# EAGLE board oboard2 (EAGLE 6.6.0), part 1 of 2
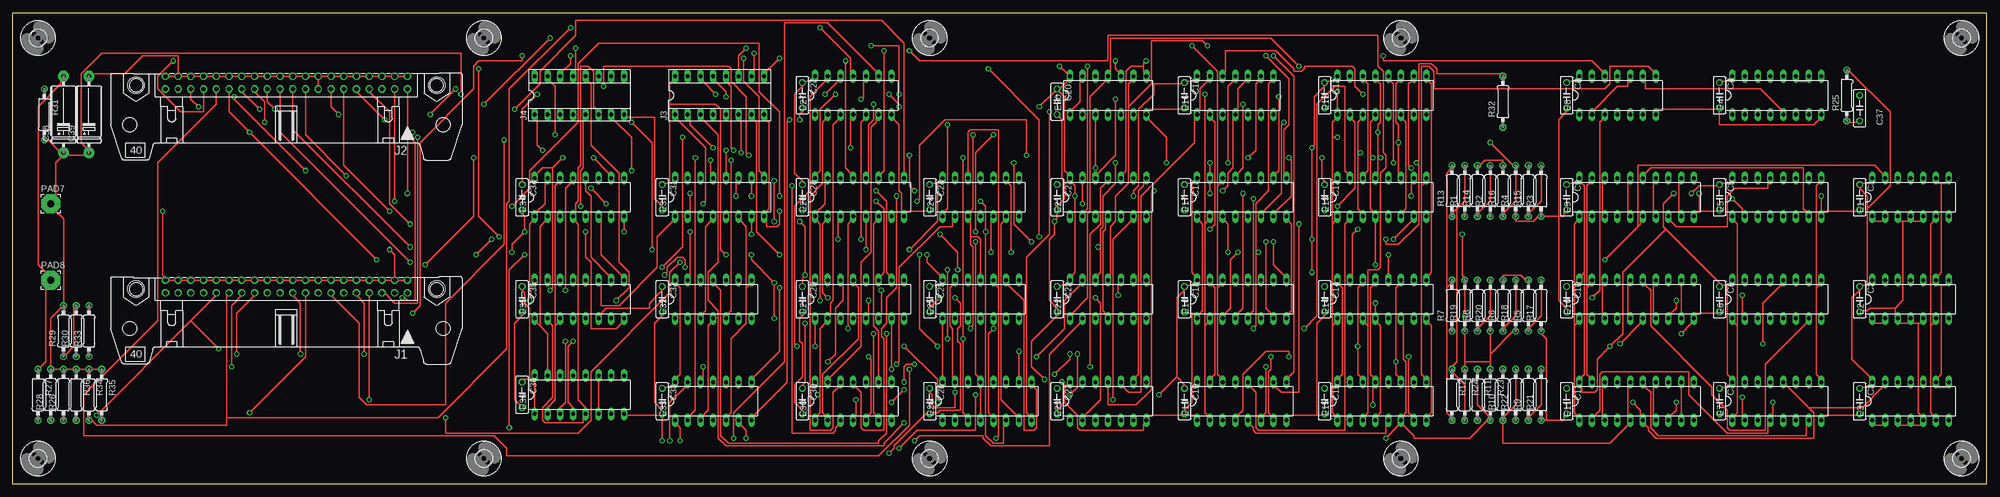
[diagram p4: board, top side]
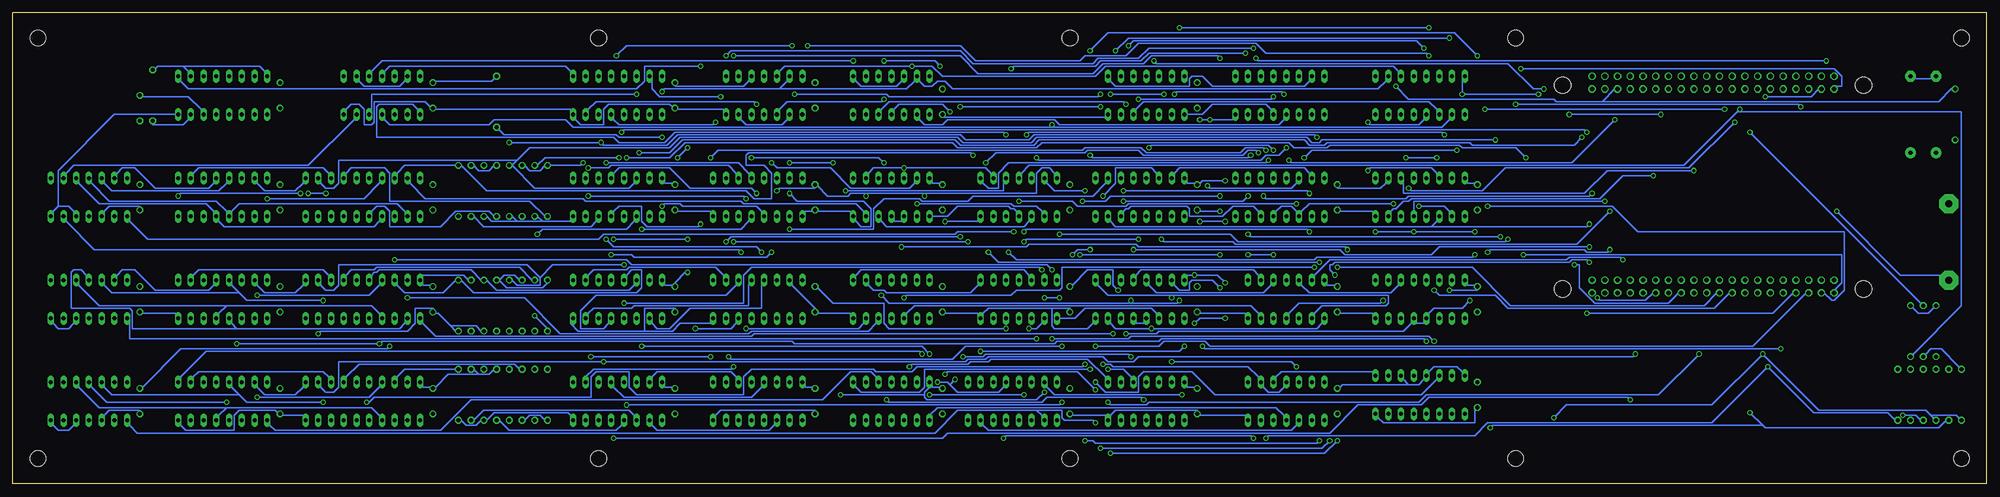
[diagram p5: board, bottom side, seen from below]

Size 393.7 x 93.98 mm. Coordinates in mm from the lower left corner, seen from the top.
Outline: 0,0 0,93.98 393.7,93.98 393.7,0 0,0
Copper layers (1*16): Top 0.035mm / dielectric 1.5mm / Bottom 0.035mm
Design rules "olimex8mil": minimum track width 10mil, minimum drill 24mil, track to track 8mil, track to pad 8mil, pad to pad 8mil, via to via 8mil, smd to smd 8mil, copper to edge 40mil, drill to drill 10mil, minimum pad ring 10mil, minimum via ring 8mil, stop-mask expansion 0mil, vias tented up to drill 0mil, thermal gap 10mil
Net classes: 1 Supply: width 0.305 mm

## Footprints (pad centres in the part's own frame; a part is rotated, then mirrored left to right if it is on the bottom)
C050-025X075 = drill 0.813 octagon: 1 -2.54,0; 2 2.54,0
E15-5 = drill 0.813 pad 2.159: + -7.62,0 | drill 0.813 pad 2.159 octagon: - 7.62,0
DIL14 = drill 0.813 long: 1 -7.62,-3.81; 2 -5.08,-3.81; 3 -2.54,-3.81; 4 0,-3.81; 5 2.54,-3.81; 6 5.08,-3.81; 7 7.62,-3.81; 8 7.62,3.81; 9 5.08,3.81; 10 2.54,3.81; 11 0,3.81; 12 -2.54,3.81; 13 -5.08,3.81; 14 -7.62,3.81
DIL16 = drill 0.813 long: 1 -8.89,-3.81; 2 -6.35,-3.81; 3 -3.81,-3.81; 4 -1.27,-3.81; 5 1.27,-3.81; 6 3.81,-3.81; 7 6.35,-3.81; 8 8.89,-3.81; 9 8.89,3.81; 10 6.35,3.81; 11 3.81,3.81; 12 1.27,3.81; 13 -1.27,3.81; 14 -3.81,3.81; 15 -6.35,3.81; 16 -8.89,3.81
DIL20 = drill 0.813 long: 1 -11.43,-3.81; 2 -8.89,-3.81; 3 -6.35,-3.81; 4 -3.81,-3.81; 5 -1.27,-3.81; 6 1.27,-3.81; 7 3.81,-3.81; 8 6.35,-3.81; 9 8.89,-3.81; 10 11.43,-3.81; 11 11.43,3.81; 12 8.89,3.81; 13 6.35,3.81; 14 3.81,3.81; 15 1.27,3.81; 16 -1.27,3.81; 17 -3.81,3.81; 18 -6.35,3.81; 19 -8.89,3.81; 20 -11.43,3.81
40H = drill 0.914: 1 -24.13,-1.27 | drill 0.914 octagon: 2 -24.13,1.27; 3 -21.59,-1.27; 4 -21.59,1.27; 5 -19.05,-1.27; 6 -19.05,1.27; 7 -16.51,-1.27; 8 -16.51,1.27; 9 -13.97,-1.27; 10 -13.97,1.27; 11 -11.43,-1.27; 12 -11.43,1.27; 13 -8.89,-1.27; 14 -8.89,1.27; 15 -6.35,-1.27; 16 -6.35,1.27; 17 -3.81,-1.27; 18 -3.81,1.27; 19 -1.27,-1.27; 20 -1.27,1.27; 21 1.27,-1.27; 22 1.27,1.27; 23 3.81,-1.27; 24 3.81,1.27; 25 6.35,-1.27; 26 6.35,1.27; 27 8.89,-1.27; 28 8.89,1.27; 29 11.43,-1.27; 30 11.43,1.27; 31 13.97,-1.27; 32 13.97,1.27; 33 16.51,-1.27; 34 16.51,1.27; 35 19.05,-1.27; 36 19.05,1.27; 37 21.59,-1.27; 38 21.59,1.27; 39 24.13,-1.27; 40 24.13,1.27 | hole 3.302: -29.972,0.533; 29.972,0.533
SOCKET-16 = drill 0.813 long: 1 -8.89,-3.81; 2 -6.35,-3.81; 3 -3.81,-3.81; 4 -1.27,-3.81; 5 1.27,-3.81; 6 3.81,-3.81; 7 6.35,-3.81; 8 8.89,-3.81; 9 8.89,3.81; 10 6.35,3.81; 11 3.81,3.81; 12 1.27,3.81; 13 -1.27,3.81; 14 -3.81,3.81; 15 -6.35,3.81; 16 -8.89,3.81
3,81/1,4 = drill 1.397 pad 3.81 octagon: 1 0,0
0207/10 = drill 0.813 octagon: 1 -5.08,0; 2 5.08,0
3,2 = hole 3.2: 0,0

## Placement (x,y rotation side)
C1  [C050-025X075]  368.3,57.15 270 top
C2  [C050-025X075]  368.3,36.83 270 top
C3  [C050-025X075]  368.3,16.51 270 top
C4  [C050-025X075]  340.36,77.47 270 top
C5  [C050-025X075]  340.36,57.15 270 top
C6  [C050-025X075]  340.36,36.83 270 top
C7  [C050-025X075]  340.36,16.51 270 top
C8  [C050-025X075]  309.88,77.47 270 top
C9  [C050-025X075]  309.88,57.15 270 top
C10  [C050-025X075]  309.88,36.83 270 top
C11  [C050-025X075]  309.88,16.51 270 top
C12  [C050-025X075]  261.62,77.47 270 top
C13  [C050-025X075]  261.62,57.15 270 top
C14  [C050-025X075]  261.62,36.83 270 top
C15  [C050-025X075]  261.62,16.51 270 top
C16  [C050-025X075]  233.68,77.47 270 top
C17  [C050-025X075]  233.68,57.15 270 top
C18  [C050-025X075]  233.68,36.83 270 top
C19  [C050-025X075]  233.68,16.51 270 top
C20  [C050-025X075]  208.28,76.2 270 top
C21  [C050-025X075]  208.28,57.15 270 top
C22  [C050-025X075]  208.28,36.83 270 top
C23  [C050-025X075]  208.28,16.51 270 top
C24  [C050-025X075]  182.88,57.15 270 top
C25  [C050-025X075]  182.88,36.83 270 top
C26  [C050-025X075]  182.88,16.51 270 top
C27  [C050-025X075]  157.48,77.47 270 top
C28  [C050-025X075]  157.48,57.15 270 top
C29  [C050-025X075]  157.48,36.83 270 top
C30  [C050-025X075]  157.48,16.51 270 top
C31  [C050-025X075]  129.54,57.15 270 top
C32  [C050-025X075]  129.54,36.83 270 top
C33  [C050-025X075]  129.54,16.51 270 top
C34  [C050-025X075]  101.6,57.15 270 top
C35  [C050-025X075]  101.6,36.83 270 top
C36  [C050-025X075]  101.6,17.78 270 top
C37  36  [C050-025X075]  368.3,74.93 90 top
C38  6.8uf  [E15-5]  10.16,73.66 90 top
C39  6.8uf  [E15-5]  15.24,73.66 90 top
E1  74LS95N  [DIL14]  378.46,57.15 0 top
E2  74LS95N  [DIL14]  378.46,36.83 0 top
E3  74LS95N  [DIL14]  378.46,16.51 0 top
E4  74LS123N  [DIL16]  351.79,77.47 0 top
E5  74LS175N  [DIL16]  351.79,57.15 0 top
E6  74LS175N  [DIL16]  351.79,36.83 0 top
E7  74LS175N  [DIL16]  351.79,16.51 0 top
E8  74LS00N  [DIL14]  320.04,77.47 0 top
E9  74S244N  [DIL20]  323.85,57.15 0 top
E10  74S244N  [DIL20]  323.85,36.83 0 top
E11  74S244N  [DIL20]  323.85,16.51 0 top
E12  74LS174N  [DIL16]  273.05,77.47 0 top
E13  74LS174N  [DIL16]  273.05,57.15 0 top
E14  74LS174N  [DIL16]  273.05,36.83 0 top
E15  74LS174N  [DIL16]  273.05,16.51 0 top
E16  74LS74N  [DIL14]  243.84,77.47 0 top
E17  74LS153N  [DIL16]  245.11,57.15 0 top
E18  74LS153N  [DIL16]  245.11,36.83 0 top
E19  74LS153N  [DIL16]  245.11,16.51 0 top
E20  74LS74N  [DIL14]  218.44,77.47 0 top
E21  74LS27N  [DIL14]  218.44,57.15 0 top
E22  74LS02N  [DIL14]  218.44,36.83 0 top
E23  7416N  [DIL14]  218.44,16.51 0 top
E24  74LS04N  [DIL14]  193.04,57.15 0 top
E25  74LS27N  [DIL14]  193.04,36.83 0 top
E26  74LS75N  [DIL16]  194.31,16.51 0 top
E27  7404N  [DIL14]  167.64,77.47 0 top
E28  74367N  [DIL16]  168.91,57.15 0 top
E29  74LS138N  [DIL16]  168.91,36.83 0 top
E30  74LS00N  [DIL14]  167.64,16.51 0 top
E31  74367N  [DIL16]  140.97,57.15 0 top
E32  74LS08N  [DIL14]  139.7,36.83 0 top
E33  74LS02N  [DIL14]  139.7,16.51 0 top
E34  74367N  [DIL16]  113.03,57.15 0 top
E35  74LS138N  [DIL16]  113.03,36.83 0 top
E36  74LS174N  [DIL16]  113.03,17.78 0 top
J1  [40H]  54.61,39.37 180 top
J2  [40H]  54.61,80.01 180 top
J3  [SOCKET-16]  140.97,77.47 0 top
J4  [SOCKET-16]  113.03,77.47 0 top
PAD7  [3,81/1,4]  7.62,55.88 0 top
PAD8  [3,81/1,4]  7.62,40.64 0 top
R1  680  [0207/10]  289.56,58.42 90 top
R2  680  [0207/10]  294.64,58.42 90 top
R3  680  [0207/10]  304.8,58.42 90 top
R4  680  [0207/10]  299.72,58.42 90 top
R5  330  [0207/10]  302.26,35.56 90 top
R6  330  [0207/10]  297.18,35.56 90 top
R7  330  [0207/10]  287.02,35.56 90 top
R8  330  [0207/10]  292.1,35.56 90 top
R9  330  [0207/10]  302.26,17.78 90 top
R10  330  [0207/10]  297.18,17.78 90 top
R11  330  [0207/10]  292.1,17.78 270 top
R12  330  [0207/10]  287.02,17.78 270 top
R13  330  [0207/10]  287.02,58.42 90 top
R14  330  [0207/10]  292.1,58.42 90 top
R15  330  [0207/10]  302.26,58.42 90 top
R16  330  [0207/10]  297.18,58.42 90 top
R17  680  [0207/10]  304.8,35.56 90 top
R18  680  [0207/10]  299.72,35.56 90 top
R19  680  [0207/10]  289.56,35.56 90 top
R20  680  [0207/10]  294.64,35.56 90 top
R21  680  [0207/10]  304.8,17.78 90 top
R22  680  [0207/10]  299.72,17.78 90 top
R23  680  [0207/10]  294.64,17.78 270 top
R24  680  [0207/10]  289.56,17.78 270 top
R25  6K8  [0207/10]  365.76,77.47 270 top
R26  180  [0207/10]  10.16,17.78 90 top
R27  390  [0207/10]  5.08,17.78 270 top
R28  1K  [0207/10]  7.62,17.78 90 top
R29  180  [0207/10]  10.16,30.48 90 top
R30  390  [0207/10]  12.7,30.48 90 top
R31  1K  [0207/10]  6.35,73.66 270 top
R32  1K  [0207/10]  297.18,76.2 90 top
R33  1K  [0207/10]  15.24,30.48 90 top
R34  1K  [0207/10]  15.24,17.78 270 top
R35  1K  [0207/10]  17.78,17.78 270 top
R36  1K  [0207/10]  12.7,17.78 270 top
U$1  [3,2]  5.08,5.08 0 top
U$2  [3,2]  5.08,88.9 0 top
U$3  [3,2]  388.62,88.9 0 top
U$4  [3,2]  388.62,5.08 0 top
U$5  [3,2]  93.98,88.9 0 top
U$6  [3,2]  182.88,5.08 0 top
U$7  [3,2]  93.98,5.08 0 top
U$8  [3,2]  276.86,5.08 0 top
U$9  [3,2]  276.86,88.9 0 top
U$10  [3,2]  182.88,88.9 0 top

## Tracks (layer width: path | path; a pad name or v marks a point on that pad's centre or on a via)
!ADRLTH
  Top 0.254: E14.9 282.45,41.66 282.96,42.16 282.96,79.76 282.45,80.26 E12.9
  Bottom 0.254: E8.11 319.53,82.3 318.52,83.31 283.46,83.31 282.45,82.3 E12.9
!BFSW  (via drill 0.61)
  Top 0.254: v100.08,74.68 105.16,79.76 105.16,82.3 112.27,89.41 112.27,92.46 173.23,92.46 177.8,87.88 177.8,61.98 E28.9 | v52.32,74.68 50.8,76.2 50.8,78.23 J2.24
  Bottom 0.254: v100.08,74.68 v52.32,74.68
!BKDTACNTL  (via drill 0.61)
  Top 0.254: v164.59,48.77 164.59,52.32 E28.3 | v75.18,54.36 66.04,63.5 66.04,78.23 J2.12
  Bottom 0.254: v164.59,48.77 164.08,48.26 150.37,48.26 149.86,47.75 81.79,47.75 v75.18,54.36
!BOOTF  (via drill 0.61)
  Top 0.254: v238.76,50.8 239.78,51.82 239.78,72.14 239.27,72.64 E16.2
  Bottom 0.254: v238.76,50.8 222,50.8 222,54.86 219.96,56.9 212.85,56.9 212.34,56.39 203.2,56.39 202.18,57.4 178.31,57.4 175.77,59.94 E28.10 | E16.6 248.41,72.64 247.4,71.63 240.28,71.63 239.27,72.64 E16.2
!BUSEN  (via drill 0.61)
  Top 0.254: v110.24,38.61 110.24,58.93 111.25,59.94 E34.13
  Bottom 0.254: v110.24,38.61 109.22,37.59 98.04,37.59 95.5,35.05 54.36,35.05 51.31,38.1 J1.24
!DEP  (via drill 0.61)
  Top 0.254: v170.18,46.74 170.18,52.32 E28.5 | v79.25,47.24 55.88,70.61 55.88,78.23 J2.20
  Bottom 0.254: v170.18,46.74 129.03,46.74 128.02,45.72 110.74,45.72 109.22,47.24 v79.25,47.24
!DSPLTH
  Top 0.254: 280.92,59.44 280.92,21.84 281.43,21.34 E15.9 | 280.92,59.44 281.43,59.94 E13.9 | 280.92,59.44 280.92,83.31 282.45,83.31 283.46,82.3 283.46,78.74 317.5,78.74 318.52,79.76 318.52,83.31 326.14,83.31 327.15,82.3 E8.8
!E35-Y4
  Top 0.254: E31.1 131.57,52.32 128.52,49.28 128.52,43.18 120.9,35.56 117.35,35.56 117.35,39.62 E35.11
  Bottom 0.254: E35.11 117.35,39.62 118.87,38.1 135.13,38.1 136.65,39.62 E32.12
!EMA0  (via drill 0.61)
  Top 0.254: 42.67,13.21 42.67,38.1 J1.30 | 42.67,13.21 42.67,11.68 16.76,11.68 15.75,12.7 R34.2 | v161.04,90.93 167.13,84.84 167.13,82.3 E27.11 | v111.25,90.93 99.06,78.74 99.06,56.39 98.55,55.88 98.55,26.92 84.84,13.21 42.67,13.21
  Bottom 0.254: v111.25,90.93 v161.04,90.93
!EMA1  (via drill 0.61)
  Top 0.254: v43.69,23.37 43.69,35.56 45.72,37.59 J1.28 | v143.76,9.14 143.76,14.22 153.92,24.38 153.92,91.95 162.56,91.95 172.21,82.3 E27.9
  Bottom 0.254: R35.2 18.29,12.7 19.81,14.22 34.54,14.22 v43.69,23.37 54.86,12.19 99.57,12.19 102.11,9.65 143.26,9.65 v143.76,9.14
!EMA2  (via drill 0.61)
  Top 0.254: 35.56,32.51 40.64,37.59 J1.32 | v16.76,13.72 35.56,32.51 | v156.46,27.43 155.96,27.94 155.96,55.37 159,58.42 159,77.22 162.05,80.26 E27.13 | 35.56,32.51 v41.15,26.92
  Bottom 0.254: v16.76,13.72 14.22,13.72 13.21,12.7 R36.2 | v156.46,27.43 155.96,26.92 v41.15,26.92
!EMODE  (via drill 0.61)
  Top 0.254: 382.52,31.5 382.52,14.22 383.03,13.72 E3.6 | 382.52,31.5 383.03,32 E2.6 | 382.52,31.5 382.52,51.82 383.03,52.32 E1.6 | v247.4,30.99 247.9,31.5 247.9,46.23 | 247.9,46.23 247.9,55.88 250.44,58.42 250.44,79.76 250.95,80.26 E16.8 | 247.9,46.23 v248.41,46.23
  Bottom 0.254: v247.4,30.99 225.04,30.99 224.03,32 E22.6 | v248.41,46.23 248.92,46.74 377.44,46.74 383.03,52.32 E1.6
!FUN  (via drill 0.61)
  Top 0.254: v191.01,30.99 191.52,31.5 191.52,47.24 191.01,47.75 191.01,49.28 | 191.01,49.28 191.01,52.32 E24.3 191.01,54.36 191.52,54.86 v191.52,69.6 | 191.01,49.28 192.53,49.28 193.04,48.77 193.04,41.66 E25.11 | v108.2,69.6 108.2,79.25 107.19,80.26 J4.15
  Bottom 0.254: v191.01,30.99 189.48,30.99 188.47,32 E25.2 | E21.5 220.47,52.32 219.46,51.31 192.02,51.31 191.01,52.32 E24.3 | v108.2,69.6 108.71,70.1 191.01,70.1 v191.52,69.6
!GATEENT  (via drill 0.61)
  Top 0.254: 313.94,39.12 313.94,21.84 314.45,21.34 E11.19 | 313.94,39.12 314.45,39.62 E10.19 | 313.94,39.12 313.94,59.44 314.45,59.94 E9.19 | v168.15,16.76 168.15,13.72 E30.4 | v219.46,16.76 219.46,48.77 223.01,52.32 E21.6
  Bottom 0.254: v168.15,16.76 168.66,17.27 187.45,17.27 188.47,16.26 218.95,16.26 v219.46,16.76 | E9.19 314.45,59.94 311.4,56.9 279.91,56.9 279.4,56.39 248.41,56.39 247.9,55.88 225.55,55.88 224.03,54.36 E21.6
!GATESR  (via drill 0.61)
  Top 0.254: 311.4,31.5 311.4,14.22 311.91,13.72 E11.1 | 311.4,31.5 311.91,32 E10.1 | v174.24,29.97 174.24,10.16 172.72,8.64 172.72,8.13 142.75,8.13 141.22,9.65 141.22,38.61 140.21,39.62 E32.11 | 311.4,31.5 311.4,51.82 311.91,52.32 E9.1
  Bottom 0.254: v174.24,29.97 245.87,29.97 246.38,29.46 309.37,29.46 311.91,32 E10.1
!IND1  (via drill 0.61)
  Top 0.254: v79.25,51.82 75.18,55.88 75.18,74.17 71.12,78.23 J2.8
  Bottom 0.254: 110.74,51.31 109.73,52.32 E34.3 | 110.74,51.31 173.74,51.31 174.75,52.32 E28.7 | v79.25,51.82 79.76,51.31 110.74,51.31
!IND2  (via drill 0.61)
  Top 0.254: v76.2,56.39 76.2,78.23 J2.4
  Bottom 0.254: v76.2,56.39 114.3,56.39 114.3,54.36 E34.5
!INIT  (via drill 0.61)
  Top 0.254: v145.8,84.84 145.8,80.26 148.84,77.22 148.84,62.48 149.35,61.98 E31.9 | v32,84.33 28.96,81.28 28.96,78.74 33.53,74.17 38.1,74.17 38.1,78.23 J2.34
  Bottom 0.254: v145.8,84.84 145.29,84.33 v32,84.33
!KEY-F  (via drill 0.61)
  Top 0.254: E26.4 193.04,13.72 193.04,19.3 E26.13 192.53,21.34 192.02,21.84 v192.02,48.26 | v169.16,48.77 169.16,72.14 169.67,72.64 E27.5
  Bottom 0.254: J4.3 109.73,74.68 111.25,76.2 168.15,76.2 169.67,74.68 E27.5 | v192.02,48.26 191.52,48.77 v169.16,48.77
!KEYCNTL  (via drill 0.61)
  Top 0.254: v139.19,64.52 139.19,61.98 E31.13 | v74.17,72.64 68.58,78.23 J2.10
  Bottom 0.254: v139.19,64.52 138.68,64.01 82.8,64.01 v74.17,72.64
!KEYSTB  (via drill 0.61)
  Top 0.254: v213.36,55.88 213.36,59.94 E21.13 | v242.32,64.01 242.32,79.25 243.33,80.26 E16.11 | v176.28,23.88 176.78,24.38 176.78,43.18 184.91,51.31 187.45,51.31 187.45,52.32 E24.2
  Bottom 0.254: E33.11 140.21,19.3 141.22,18.29 143.26,18.29 144.27,19.3 E33.9 145.29,21.34 147.32,23.37 174.24,23.37 174.75,23.88 v176.28,23.88 | v213.36,55.88 194.56,55.88 194.06,55.37 189.48,55.37 188.47,54.36 E24.2 | v242.32,64.01 241.3,62.99 230.63,62.99 226.57,58.93 214.88,58.93 213.87,59.94 E21.13
!KFUN0  (via drill 0.61)
  Top 0.254: E3.2 372.87,11.68 371.35,11.68 E3.1 | v177.8,12.19 173.74,8.13 173.74,7.62 142.24,7.62 140.72,9.14 140.72,34.54 138.68,36.58 138.68,42.16 140.72,44.2 140.72,69.6 137.67,72.64 J3.3
  Bottom 0.254: 189.48,14.73 188.47,13.72 E26.2 | 189.48,14.73 205.23,14.73 209.8,10.16 368.81,10.16 370.33,11.68 E3.1 | v177.8,12.19 178.31,12.7 183.9,12.7 184.4,13.21 184.4,14.73 189.48,14.73
!KFUN1  (via drill 0.61)
  Top 0.254: E2.1 371.35,32 372.87,32 E2.2 | v189.48,65.02 v189.48,28.96 189.48,14.22 189.99,13.72 E26.3 | v139.7,67.06 135.13,71.63 135.13,72.64 J3.2
  Bottom 0.254: v189.48,65.02 188.98,64.52 144.78,64.52 143.76,65.53 141.22,65.53 v139.7,67.06 | v189.48,28.96 370.33,28.96 370.33,32 E2.1
!KFUN2  (via drill 0.61)
  Top 0.254: E1.1 371.35,52.32 372.87,52.32 E1.2 | v137.67,55.88 138.18,56.39 138.18,67.06 132.59,72.64 J3.1 | v193.04,56.39 194.06,55.37 v194.06,50.29 194.06,9.65 195.58,8.13 197.61,8.13 197.61,11.68 E26.6
  Bottom 0.254: v137.67,55.88 171.2,55.88 171.7,55.37 181.36,55.37 182.37,56.39 v193.04,56.39 | v194.06,50.29 205.23,50.29 205.74,49.78 275.84,49.78 276.86,48.77 366.78,48.77 370.33,52.32 E1.1
!LAENAB  (via drill 0.61)
  Top 0.254: v215.9,37.08 216.92,36.07 216.92,16.76 213.87,13.72 E23.2 | v134.11,43.18 134.11,44.7 133.6,45.21 132.59,45.21 130.56,43.18 130.56,42.16 v130.05,41.66 | v79.25,44.2 53.34,70.1 53.34,78.23 J2.22
  Bottom 0.254: v215.9,37.08 215.39,37.59 194.56,37.59 193.55,38.61 184.91,38.61 184.4,39.12 184.4,43.18 v134.11,43.18 | v130.05,41.66 131.06,42.67 131.06,43.69 130.56,43.69 130.05,44.2 83.31,44.2 82.8,44.7 79.76,44.7 v79.25,44.2
!MAEN  (via drill 0.61)
  Top 0.254: v178.82,22.86 178.82,11.68 172.72,5.59 98.55,5.59 98.55,7.11 96.01,9.65 14.22,9.65 14.22,17.78 28.96,32.51 28.96,64.01 40.64,75.69 40.64,78.23 J2.32
  Bottom 0.254: v178.82,22.86 211.84,22.86 211.84,19.3 212.85,18.29 224.54,18.29 225.55,19.3 E23.8
!MALC  (via drill 0.61)
  Top 0.254: v173.74,86.36 173.74,62.48 173.23,61.98 E28.11 | v107.19,88.9 v93.98,75.69 | v37.08,75.18 35.56,76.71 35.56,78.23 J2.36
  Bottom 0.254: v173.74,86.36 171.2,88.9 v107.19,88.9 | v93.98,75.69 37.59,75.69 v37.08,75.18
!MCLOCK  (via drill 0.61)
  Top 0.254: v136.14,65.02 136.14,14.73 135.13,13.72 E33.2 | v105.66,66.55 104.65,67.56 104.65,72.64 J4.1
  Bottom 0.254: v136.14,65.02 134.62,66.55 v105.66,66.55
!MD  (via drill 0.61)
  Top 0.254: v66.55,61.47 58.42,69.6 58.42,78.23 J2.18
  Bottom 0.254: v66.55,61.47 72.64,61.47 77.22,56.9 114.81,56.9 115.32,56.39 116.33,56.39 117.86,54.86 118.36,54.86 118.87,54.36 E34.7
!MEMSTART  (via drill 0.61)
  Top 0.254: v50.29,72.14 50.29,76.2 48.26,78.23 J2.26 | v115.32,58.93 v118.36,55.88
  Bottom 0.254: E31.5 141.73,54.36 140.72,55.37 138.68,55.37 137.67,54.36 E31.3 136.65,54.36 135.13,55.88 v118.36,55.88 | v50.29,72.14 59.44,62.99 96.01,62.99 100.58,58.42 114.81,58.42 v115.32,58.93
!MH0  (via drill 0.61)
  Top 0.254: E8.2 315.47,74.68 320.04,79.25 322.07,79.25 322.07,80.26 E8.10 | 225.55,83.31 223.01,83.31 222,82.3 222,62.48 221.49,61.98 E21.10 | 225.55,83.31 225.55,82.3 E20.8 | v226.06,84.33 225.55,83.82 225.55,83.31
  Bottom 0.254: E20.12 216.41,80.26 217.42,79.25 224.54,79.25 225.55,80.26 E20.8 | v226.06,84.33 320.04,84.33 322.07,82.3 E8.10
!MSIRDIS  (via drill 0.61)
  Top 0.254: v144.27,57.4 144.27,59.94 E31.11 | v78.74,57.91 78.74,78.23 J2.2
  Bottom 0.254: v144.27,57.4 143.76,56.9 115.82,56.9 115.32,57.4 79.25,57.4 v78.74,57.91
!PANLOCK  (via drill 0.61)
  Top 0.254: v179.83,58.42 178.82,59.44 v178.82,65.53 | v146.81,65.53 146.3,66.04 146.3,77.22 143.26,80.26 143.26,82.8 142.75,83.31 117.86,83.31 v117.86,79.25
  Bottom 0.254: v179.83,58.42 185.93,58.42 187.45,59.94 E24.13 | v178.82,65.53 178.31,65.02 147.32,65.02 v146.81,65.53 | v117.86,79.25 115.32,76.71 86.36,76.71 85.85,76.2 76.71,76.2 | 76.71,76.2 74.17,78.74 J2.6 | 76.71,76.2 9.65,76.2 7.11,78.74 R31.1
!PULSELOADADD  (via drill 0.61)
  Top 0.254: v147.32,49.78 147.32,52.32 E31.7 | v97.03,49.28 92.96,53.34 v92.96,82.8
  Bottom 0.254: v147.32,49.78 146.81,49.28 v97.03,49.28 | v92.96,82.8 30.48,82.8 28.96,81.28 28.96,79.25 30.48,79.25 J2.40
!RUN  (via drill 0.61)
  Top 0.254: v47.24,14.22 58.42,25.4 58.42,37.59 J1.18 | v195.07,46.23 195.07,52.32 E24.5 | v102.11,45.72 99.06,42.67 v99.06,11.18
  Bottom 0.254: 44.7,11.68 v47.24,14.22 | 44.7,11.68 44.2,11.18 9.65,11.18 8.13,12.7 R28.1 | v195.07,46.23 193.55,44.7 134.11,44.7 133.6,45.21 102.62,45.21 v102.11,45.72 | v99.06,11.18 98.55,11.68 44.7,11.68
!SHLT
  Bottom 0.254: J3.5 142.75,74.68 143.76,75.69 154.43,75.69 156.46,73.66 159.51,73.66 E27.1
!SINGSTEP  (via drill 0.61)
  Top 0.254: v166.12,84.33 166.12,62.99 167.13,61.98 E28.13 | v83.31,73.66 v88.39,78.74 | v65.02,73.66 63.5,75.18 63.5,78.23 J2.14
  Bottom 0.254: v166.12,84.33 165.61,83.82 95.5,83.82 90.42,78.74 v88.39,78.74 | v65.02,73.66 v83.31,73.66
!SRDATA  (via drill 0.61)
  Top 0.254: R29.1 10.67,25.91 12.19,27.43 12.19,35.05 R30.2 | v72.64,44.7 v47.24,70.1 43.18,74.17 43.18,78.23 J2.30 | v195.58,69.6 192.02,66.04 v192.02,50.29 | v135.13,50.29 135.13,41.66 E32.13
  Bottom 0.254: v72.64,44.7 73.15,45.21 83.31,45.21 83.82,44.7 131.06,44.7 134.11,41.66 E32.13 | v195.58,69.6 196.09,70.1 261.62,70.1 263.65,68.07 272.8,68.07 273.81,69.09 321.06,69.09 321.06,75.18 320.55,75.69 313.94,75.69 312.93,74.68 E8.1 | v192.02,50.29 191.52,50.8 135.64,50.8 v135.13,50.29 | v47.24,70.1 13.21,36.07 R30.2
!STATE  (via drill 0.61)
  Top 0.254: v58.42,62.48 44.2,76.71 v44.2,77.22
  Bottom 0.254: v58.42,62.48 75.69,62.48 80.26,57.91 116.33,57.91 116.33,59.94 E34.11 | v44.2,77.22 35.05,77.22 33.53,78.74 J2.38
!STHIS
  Bottom 0.254: J3.4 140.21,72.64 141.22,71.63 184.91,71.63 185.93,72.64 207.26,72.64 208.28,71.63 211.84,71.63 212.85,72.64 E20.2
!TSI  (via drill 0.61)
  Top 0.254: v215.9,62.99 215.9,72.64 E20.3 | v44.7,25.91 44.7,34.04 48.26,37.59 J1.26 | v199.14,46.23 199.14,59.44 198.63,59.94 E24.9 | v133.1,44.2 131.06,42.16 131.06,38.1 115.32,22.35 115.32,12.7 112.78,10.16 86.36,10.16 v86.36,13.21
  Bottom 0.254: E24.9 198.63,61.98 199.64,62.99 v215.9,62.99 222,62.99 223.01,61.98 E21.9 | 11.18,13.72 10.67,13.21 R26.1 | 11.18,13.72 12.19,14.73 33.53,14.73 v44.7,25.91 54.86,15.75 83.82,15.75 v86.36,13.21 | 11.18,13.72 6.1,13.72 5.59,13.21 R27.2 | v199.14,46.23 197.1,44.2 v133.1,44.2
ADDR0  (via drill 0.61)
  Top 0.254: v251.46,48.26 251.46,43.69 253.49,41.66 E18.9 | v204.72,49.28 204.72,72.64 v194.56,82.8 | v147.83,85.85 147.83,82.3 J3.10
  Bottom 0.254: v251.46,48.26 250.44,49.28 v204.72,49.28 | v194.56,82.8 194.06,83.31 177.8,83.31 176.78,84.33 168.66,84.33 167.13,85.85 v147.83,85.85
ADDR1  (via drill 0.61)
  Top 0.254: v254.51,65.02 255.02,64.52 255.02,57.4 251.97,54.36 E17.7 | v143.76,66.55 143.26,67.06 143.26,79.25 142.75,79.76 142.75,80.26 J3.12
  Bottom 0.254: v254.51,65.02 252.98,66.55 180.34,66.55 179.83,67.06 168.66,67.06 167.64,66.04 148.84,66.04 147.83,67.06 144.27,67.06 v143.76,66.55
ADDR2  (via drill 0.61)
  Top 0.254: v249.94,85.34 254.51,80.77 254.51,71.63 253.49,70.61 253.49,61.98 E17.9 | v152.91,84.84 150.37,82.3 J3.9
  Bottom 0.254: v249.94,85.34 204.72,85.34 201.17,81.79 178.31,81.79 176.28,83.82 168.15,83.82 166.62,85.34 153.42,85.34 v152.91,84.84
BEMA0  (via drill 0.61)
  Top 0.254: v142.24,77.22 142.24,78.23 140.21,80.26 J3.13 | v169.16,76.71 169.67,77.22 169.67,80.26 E27.10
  Bottom 0.254: v142.24,77.22 142.75,76.71 v169.16,76.71
BEMA1
  Bottom 0.254: J3.15 135.13,80.26 136.14,79.25 154.43,79.25 156.46,81.28 158.5,81.28 159,80.77 159,79.25 173.74,79.25 174.75,80.26 E27.8
BEMA2  (via drill 0.61)
  Top 0.254: v140.21,77.72 137.67,80.26 J3.14 | v162.05,77.72 164.59,80.26 E27.12
  Bottom 0.254: v140.21,77.72 140.72,78.23 161.54,78.23 v162.05,77.72
BPOK  (via drill 0.61)
  Top 0.254: E20.1 211.33,74.68 212.85,76.2 212.85,80.26 E20.13 | 263.14,31.5 263.14,14.22 263.65,13.72 E15.1 | 263.14,31.5 263.65,32 E14.1 | 263.14,51.82 263.65,52.32 E13.1 | 263.14,31.5 263.14,51.82 | 263.14,51.82 263.14,69.09 | 263.14,69.09 263.14,72.14 263.65,72.64 E12.1 264.16,74.68 v264.16,78.23 | 263.14,69.09 v264.16,69.09 | 343.92,31.5 343.92,14.22 343.41,13.72 E7.1 | 343.92,31.5 343.41,32 E6.1 | 343.92,31.5 343.92,51.82 343.41,52.32 E5.1 | E23.10 221.49,19.3 222.5,18.29 225.04,18.29 225.04,57.4 235.71,68.07 235.71,72.64 E16.1 236.73,74.68 236.73,78.74 238.25,80.26 E16.13
  Bottom 0.254: J4.10 119.89,80.26 121.41,78.74 206.25,78.74 207.77,80.26 209.3,80.26 210.31,79.25 211.84,79.25 212.85,80.26 E20.13 213.87,80.26 215.39,78.74 240.79,78.74 | v264.16,69.09 272.8,69.09 273.3,69.6 295.66,69.6 296.67,70.61 R32.1 | E7.1 342.39,11.68 341.38,10.67 308.36,10.67 302.26,16.76 232.16,16.76 226.57,22.35 222.5,22.35 221.49,21.34 E23.10 | v264.16,78.23 263.65,78.74 240.79,78.74 | 240.79,78.74 239.27,80.26 E16.13
BRUN  (via drill 0.61)
  Top 0.254: E26.7 200.15,13.72 197.1,16.76 197.1,51.82 197.61,52.32 E24.6 | E33.3 137.67,13.72 138.68,14.73 138.68,31.5 139.19,32 E32.4 | v120.4,36.58 122.94,39.12 122.94,42.16 120.9,44.2 120.9,61.98 115.32,67.56 115.32,79.76 114.81,80.26 J4.12
  Bottom 0.254: v120.4,36.58 120.9,36.07 137.16,36.07 139.19,34.04 E32.4 | E26.7 200.15,11.68 199.14,10.67 138.68,10.67 137.67,11.68 E33.3
BUS0  (via drill 0.61)
  Top 0.254: E11.3 316.99,13.72 316.99,19.3 E11.18 | R9.1 302.26,13.21 304.8,15.75 304.8,22.35 R21.2 | 270.26,31.5 270.26,14.22 269.75,13.72 E15.3 | 270.26,31.5 269.75,32 E14.3 | v79.76,34.04 81.28,35.56 81.28,68.07 91.95,78.74 91.95,83.31 92.96,84.33 101.6,84.33 v101.6,85.34 | v178.82,86.36 180.85,84.33 218.44,84.33 218.44,89.41 272.29,89.41 272.29,83.31 273.3,82.3 273.3,66.04 273.81,65.53 273.81,62.99 272.8,61.98 272.8,43.18 272.29,42.67 270.26,42.67 270.26,31.5
  Bottom 0.254: E11.18 316.99,21.34 315.47,22.86 305.31,22.86 R21.2 | v79.76,34.04 42.67,34.04 38.61,38.1 J1.34 | v101.6,85.34 106.17,89.92 175.26,89.92 v178.82,86.36 | R9.1 301.75,12.7 299.72,14.73 270.76,14.73 269.75,13.72 E15.3
BUS1  (via drill 0.61)
  Top 0.254: E10.3 316.99,34.04 316.99,39.62 E10.18 | R5.1 302.26,30.99 304.8,33.53 304.8,40.13 R17.2 | E14.13 271.27,39.62 270.76,39.12 270.76,21.84 271.27,21.34 E15.13 271.27,19.3 v271.27,15.75 | v177.8,27.43 184.4,20.83 v184.4,16.26
  Bottom 0.254: E10.18 316.99,39.62 315.47,38.1 307.85,38.1 305.31,40.64 R17.2 304.29,40.64 301.75,38.1 269.24,38.1 268.22,39.12 268.22,42.67 270.26,42.67 271.27,41.66 E14.13 | v177.8,27.43 165.1,27.43 164.08,28.45 155.96,28.45 154.94,27.43 46.74,27.43 36.07,38.1 J1.36 | v184.4,16.26 184.91,15.75 v271.27,15.75
BUS2  (via drill 0.61)
  Top 0.254: E13.6 277.37,54.36 277.88,54.86 277.88,72.14 277.37,72.64 E12.6 | E9.3 316.99,54.36 316.99,59.94 E9.18 | R15.1 302.26,53.85 304.8,56.39 304.8,62.99 R3.2 | v99.57,55.37 103.12,58.93 103.12,62.48 112.78,72.14 112.78,83.82 116.84,87.88 148.84,87.88 148.84,78.23 152.91,74.17 v152.91,57.4 | v180.34,56.39 180.85,56.9 180.85,67.56 185.93,72.64 202.18,72.64 v202.18,65.53
  Bottom 0.254: v99.57,55.37 74.68,55.37 69.6,50.29 28.45,50.29 28.45,38.61 30.48,36.58 30.99,36.58 32.51,38.1 J1.38 | v152.91,57.4 174.75,57.4 175.77,56.39 v180.34,56.39 | v202.18,65.53 202.69,66.04 246.89,66.04 247.4,65.53 247.4,63.5 243.84,63.5 242.32,61.98 242.32,56.9 245.87,56.9 247.4,58.42 299.21,58.42 304.29,63.5 R3.2 305.31,63.5 315.47,63.5 316.99,61.98 E9.18 | E13.6 277.37,52.32 278.38,51.31 299.72,51.31 301.75,53.34 R15.1
BUS3  (via drill 0.61)
  Top 0.254: E11.16 322.07,19.3 322.07,13.72 E11.5 322.07,11.68 318.52,8.13 297.18,8.13 297.18,12.19 R10.1 297.18,13.21 299.72,15.75 299.72,22.35 R22.2 | E15.4 272.29,13.72 272.8,14.22 272.8,31.5 272.29,32 E14.4 271.78,34.04 v271.78,36.07 | v95.5,48.77 v92.46,45.72 | v184.91,49.78 188.47,46.23 v188.47,42.67
  Bottom 0.254: v92.46,45.72 28.96,45.72 28.96,40.13 30.48,38.61 J1.40 | v95.5,48.77 96.01,48.26 149.35,48.26 150.88,49.78 v184.91,49.78 | v188.47,42.67 188.98,43.18 246.38,43.18 247.9,41.66 247.9,36.07 v271.78,36.07 | R10.1 296.67,12.7 294.64,10.67 273.3,10.67 272.29,11.68 E15.4
BUS4  (via drill 0.61)
  Top 0.254: E10.5 322.07,34.04 322.07,39.62 E10.16 | R6.1 297.18,30.99 299.72,33.53 299.72,40.13 R18.2 | E15.14 268.73,21.34 268.22,21.84 v268.22,27.43 268.22,39.12 268.73,39.62 E14.14 | v57.4,25.91 57.4,36.07 55.88,37.59 J1.20 | v177.8,18.8 v175.26,16.26 | v207.77,21.84 210.82,24.89 v210.82,25.91
  Bottom 0.254: E10.16 322.07,41.66 321.56,42.16 321.06,42.16 320.55,42.67 302.26,42.67 300.23,40.64 R18.2 299.21,40.64 297.18,38.61 270.76,38.61 269.75,39.62 E14.14 | v57.4,25.91 65.53,17.78 111.76,17.78 113.28,16.26 167.13,16.26 167.64,15.75 174.75,15.75 v175.26,16.26 | v177.8,18.8 181.36,22.35 207.26,22.35 v207.77,21.84 | v210.82,25.91 212.34,27.43 v268.22,27.43
BUS5  (via drill 0.61)
  Top 0.254: E9.5 322.07,54.36 322.07,59.94 E9.16 | R16.1 297.18,53.85 299.72,56.39 299.72,62.99 R4.2 299.21,63.5 v294.64,68.07 | E13.11 276.35,61.98 v276.35,68.07 276.35,71.63 275.84,72.14 275.84,79.76 276.35,80.26 E12.11 | v129.54,43.18 133.6,47.24 v133.6,69.09
  Bottom 0.254: E9.5 322.07,54.36 321.06,55.37 319.53,55.37 318.52,54.36 318.52,51.31 308.36,51.31 305.31,54.36 298.7,54.36 297.69,53.34 R16.1 | v129.54,43.18 102.62,43.18 95,35.56 56.39,35.56 53.85,38.1 J1.22 | v133.6,69.09 134.11,69.6 189.99,69.6 191.01,68.58 203.71,68.58 204.72,69.6 261.11,69.6 263.14,67.56 275.84,67.56 v276.35,68.07 v294.64,68.07
BUS6  (via drill 0.61)
  Top 0.254: E11.7 327.15,13.72 327.15,19.3 E11.14 | R11.1 292.1,22.35 292.1,15.75 294.64,13.21 R23.2 294.13,12.7 290.58,9.14 279.4,9.14 279.4,9.65 277.37,11.68 E15.6 | E15.6 277.37,13.72 277.88,14.22 277.88,24.38 277.37,24.89 277.37,32 E14.6 | v71.12,16.76 71.12,37.59 J1.8 | v273.81,9.14 276.35,11.68 E15.6
  Bottom 0.254: E11.14 327.15,21.34 324.61,23.88 293.62,23.88 292.61,22.86 R11.1 | v71.12,16.76 71.63,17.27 111.25,17.27 112.78,15.75 125.48,15.75 131.06,10.16 207.26,10.16 208.28,9.14 v273.81,9.14
BUS7  (via drill 0.61)
  Top 0.254: E10.7 327.15,34.04 327.15,39.62 E10.14 | v289.56,33.53 289.56,40.13 R19.2 289.56,41.15 289.05,41.66 v289.05,49.78 | 268.22,66.04 268.22,72.14 268.73,72.64 E12.3 | 268.22,66.04 268.22,54.86 268.73,54.36 E13.3 | v80.77,69.09 80.77,36.07 76.2,36.07 74.17,38.1 J1.6 | v268.73,66.04 268.22,66.04
  Bottom 0.254: v289.56,33.53 287.02,30.99 R7.1 | E10.14 327.15,41.66 326.14,42.67 321.56,42.67 321.06,43.18 292.61,43.18 290.07,40.64 R19.2 | v80.77,69.09 82.3,67.56 102.62,67.56 103.12,68.07 131.57,68.07 132.08,67.56 135.13,67.56 136.14,68.58 188.98,68.58 189.99,67.56 204.72,67.56 205.74,68.58 260.1,68.58 262.64,66.04 v268.73,66.04 | v289.05,49.78 288.04,50.8 271.27,50.8 269.75,52.32 E13.3
BUS8  (via drill 0.61)
  Top 0.254: R24.2 289.56,13.21 289.56,19.81 287.02,22.35 R12.1 287.02,23.37 288.04,24.38 288.04,54.86 | E9.7 327.15,54.36 327.15,59.94 E9.14 | 288.04,54.86 289.56,56.39 289.56,62.99 R1.2 | 288.04,54.86 287.02,53.85 R13.1 | 272.29,65.02 v272.29,70.1 272.29,71.63 272.8,72.14 272.8,79.76 272.29,80.26 E12.13 | 272.29,65.02 272.29,61.98 E13.13 | v77.72,37.08 78.23,37.08 78.74,36.58 80.26,36.58 80.26,68.07 79.76,68.58 v79.76,70.1 | v272.8,65.02 272.29,65.02
  Bottom 0.254: E9.14 327.15,61.98 326.14,62.99 319.53,62.99 318.52,61.98 318.52,56.39 290.58,56.39 287.53,53.34 R13.1 | v77.72,37.08 77.22,36.58 68.07,36.58 66.55,38.1 J1.12 | v79.76,70.1 80.26,70.61 271.78,70.61 v272.29,70.1 | v272.8,65.02 287.53,65.02 289.05,63.5 R1.2
BUS9  (via drill 0.61)
  Top 0.254: E11.9 332.74,13.72 332.74,19.3 E11.12 | E15.11 276.35,21.34 275.84,21.84 v275.84,24.38 275.84,39.12 276.35,39.62 E14.11 | v70.1,25.91 70.1,36.07 68.58,37.59 J1.10
  Bottom 0.254: v70.1,25.91 70.61,25.4 169.16,25.4 170.18,24.38 175.26,24.38 176.28,25.4 199.14,25.4 199.64,24.89 203.2,24.89 203.71,24.38 v275.84,24.38 328.68,24.38 328.68,19.3 329.69,18.29 331.22,18.29 332.23,19.3 E11.12
BUS10  (via drill 0.61)
  Top 0.254: E10.9 332.74,34.04 332.74,39.62 E10.12 | R8.1 292.1,30.99 294.64,33.53 294.64,40.13 R20.2 | 270.76,65.02 270.76,72.14 271.27,72.64 E12.4 | 270.76,65.02 270.76,54.86 271.27,54.36 E13.4 271.78,52.32 v271.78,43.69 | v82.3,43.69 91.95,53.34 v91.95,65.02 | v271.27,65.02 270.76,65.02
  Bottom 0.254: 288.54,41.15 291.08,43.69 328.68,43.69 328.68,39.62 329.69,38.61 331.22,38.61 332.23,39.62 E10.12 | 288.54,41.15 288.54,39.62 293.12,39.62 294.13,40.64 R20.2 | v82.3,43.69 81.28,43.69 81.28,39.12 78.23,36.07 63.5,36.07 61.47,38.1 J1.16 | v91.95,65.02 93.98,67.06 104.65,67.06 105.16,67.56 131.06,67.56 131.57,67.06 138.18,67.06 139.19,68.07 188.47,68.07 189.48,67.06 205.23,67.06 206.25,68.07 259.59,68.07 262.64,65.02 v271.27,65.02 | 288.54,41.15 286,43.69 v271.78,43.69
BUS11  (via drill 0.61)
  Top 0.254: E13.14 269.75,61.98 270.26,62.48 270.26,79.76 269.75,80.26 E12.14 | E9.9 332.23,54.36 332.23,59.94 E9.12 | R14.1 292.1,53.85 294.64,56.39 294.64,62.99 R2.2 | v98.04,68.58 98.04,47.75 86.36,36.07 86.36,15.75 70.61,15.75 69.09,17.27 69.09,32 63.5,37.59 J1.14
  Bottom 0.254: v98.04,68.58 132.59,68.58 133.1,68.07 134.62,68.07 135.64,69.09 189.48,69.09 190.5,68.07 204.22,68.07 205.23,69.09 260.6,69.09 262.64,67.06 290.58,67.06 293.12,64.52 | 293.12,64.52 294.13,63.5 | 294.13,63.5 R2.2 294.13,63.5 | 293.12,64.52 328.68,64.52 328.68,59.94 329.69,58.93 331.22,58.93 332.23,59.94 E9.12 | 294.13,63.5 289.56,58.93 270.76,58.93 269.75,59.94 E13.14
DISP0  (via drill 0.61)
  Top 0.254: 105.16,31.5 106.68,29.97 106.68,22.86 E36.15 | 105.16,31.5 104.65,32 E35.1 | 105.16,31.5 105.16,51.31 106.17,52.32 E34.2 | v113.28,55.37 113.28,62.48 113.79,62.99 113.79,72.64 J4.5
  Bottom 0.254: v113.28,55.37 108.2,55.37 107.19,54.36 E34.2
DISP1
  Top 0.254: E35.2 107.19,32 107.7,31.5 107.7,17.27 105.66,15.24 105.66,12.7 106.17,12.19 113.79,12.19 113.79,13.21 E36.5 114.3,15.24 112.78,16.76 112.78,51.82 112.27,52.32 E34.4 112.27,54.36 112.27,55.88 112.78,56.39 112.78,62.99 113.28,63.5 113.28,83.31 114.81,83.31 115.82,82.3 115.82,75.18 116.33,74.68 J4.6
DISP2  (via drill 0.61)
  Top 0.254: 108.2,31.5 108.2,16.76 106.68,15.24 E36.2 | 108.2,31.5 108.71,32 E35.3 | 108.2,31.5 108.2,59.44 108.71,59.94 E34.14 | v123.44,62.48 123.44,69.09 119.89,72.64 J4.7
  Bottom 0.254: v123.44,62.48 122.94,62.99 110.74,62.99 109.73,61.98 E34.14
DISPINH  (via drill 0.61)
  Top 0.254: 216.92,47.24 216.92,50.8 217.42,51.31 217.42,57.4 219.96,59.94 v219.96,64.01 | 216.92,47.24 216.92,42.16 216.41,41.66 E22.12 | v246.38,65.02 247.9,66.55 247.9,79.76 248.41,80.26 E16.9 | v123.44,72.14 127.51,68.07 v127.51,46.74 | 216.92,47.24 v216.41,47.24
  Bottom 0.254: v219.96,64.01 220.98,65.02 v246.38,65.02 | v123.44,72.14 122.94,71.63 113.28,71.63 112.27,72.64 J4.4 | v127.51,46.74 128.02,47.24 169.16,47.24 169.67,47.75 191.01,47.75 191.52,47.24 v216.41,47.24
DISPLAY0  (via drill 0.61)
  Top 0.254: v250.95,25.4 250.95,22.86 250.44,22.35 250.44,14.22 250.95,13.72 E19.7 | v184.4,27.43 180.85,30.99 v180.85,45.72 | v152.91,45.72 148.34,50.29 148.34,72.14 147.83,72.64 J3.7
  Bottom 0.254: v250.95,25.4 250.44,24.89 206.25,24.89 203.71,27.43 v184.4,27.43 | v180.85,45.72 v152.91,45.72
DISPLAY1  (via drill 0.61)
  Top 0.254: v251.46,85.34 255.52,81.28 255.52,22.35 254.51,21.34 E19.9 | v146.3,86.87 144.78,85.34 144.78,82.3 J3.11
  Bottom 0.254: v251.46,85.34 250.44,86.36 204.72,86.36 202.18,83.82 178.31,83.82 177.29,84.84 169.16,84.84 167.13,86.87 v146.3,86.87
DISPLAY2  (via drill 0.61)
  Top 0.254: v249.94,48.26 249.94,35.05 250.95,34.04 E18.7 | v203.2,48.26 199.64,51.82 v199.64,64.01 | v145.29,66.04 145.29,72.64 J3.6
  Bottom 0.254: v203.2,48.26 v249.94,48.26 | v199.64,64.01 197.61,66.04 179.83,66.04 179.32,66.55 169.16,66.55 168.15,65.53 148.34,65.53 147.32,66.55 145.8,66.55 v145.29,66.04
ENT0  (via drill 0.61)
  Top 0.254: 358.14,15.24 353.57,19.81 E7.12 | 358.14,15.24 359.16,14.22 359.16,9.14 327.66,9.14 326.14,10.67 326.14,11.18 325.63,11.68 E11.6 324.61,13.72 324.61,14.73 v323.09,16.26 | 358.14,15.24 368.81,15.24 372.87,19.3 E3.13 | v177.8,20.32 177.8,23.37 178.31,23.88 v179.83,23.88
  Bottom 0.254: v177.8,20.32 175.77,18.29 169.16,18.29 169.16,21.34 168.15,22.35 158.5,22.35 153.92,17.78 112.78,17.78 109.73,20.83 E36.14 | v179.83,23.88 180.34,23.37 213.36,23.37 214.38,22.35 221.49,22.35 222,22.86 246.38,22.86 247.9,21.34 247.9,17.78 269.24,17.78 270.76,19.3 270.76,22.35 277.37,22.35 278.38,21.34 278.38,17.27 321.56,17.27 322.58,16.26 v323.09,16.26
ENT1  (via drill 0.61)
  Top 0.254: v111.76,28.45 110.74,27.43 110.74,16.26 111.76,15.24 E36.4 | v320.55,27.94 324.61,32 E10.6 | v349,27.94 349,36.07 352.55,39.62 E6.12
  Bottom 0.254: E6.12 353.57,39.62 354.58,38.61 365.25,38.61 369.32,42.67 371.86,42.67 372.87,41.66 E2.13 | v111.76,28.45 112.27,28.96 164.59,28.96 165.1,28.45 185.42,28.45 185.93,27.94 237.74,27.94 238.25,28.45 320.04,28.45 v320.55,27.94 v349,27.94
ENT2  (via drill 0.61)
  Top 0.254: v110.24,28.45 110.24,16.26 109.22,15.24 E36.3 | v186.44,42.67 v186.44,28.96 | 324.1,51.31 324.61,51.82 324.61,52.32 E9.6 | v317.5,44.7 324.1,51.31 | 324.1,51.31 324.1,63.5 371.35,63.5 372.87,61.98 E1.13
  Bottom 0.254: E5.12 353.57,59.94 354.58,58.93 365.25,58.93 369.32,62.99 371.86,62.99 372.87,61.98 E1.13 | v110.24,28.45 111.25,29.46 170.69,29.46 171.2,28.96 v186.44,28.96 | v186.44,42.67 187.45,43.69 270.26,43.69 271.27,44.7 v317.5,44.7
GND  (via drill 0.61)
  Top 0.305: E3.3 376.43,11.68 377.95,11.68 E3.4 378.97,11.68 380.49,11.68 E3.5 380.49,13.72 379.98,14.22 379.98,32 | E7.8 361.19,13.72 367.79,13.72 C3.2 | E8.7 328.17,74.68 339.85,74.68 C4.2 340.36,74.17 340.36,71.63 359.16,71.63 360.17,72.64 E4.8 | 379.98,32 378.97,32 E2.4 377.95,32 376.43,32 E2.3 375.41,34.04 375.41,35.05 | 379.98,32 380.49,32 E2.5 | 375.41,35.05 370.33,35.05 369.82,34.54 368.81,34.54 C2.2 | 376.94,52.32 377.95,52.32 E1.4 378.97,52.32 380.49,52.32 E1.5 | 376.94,52.32 376.43,52.32 E1.3 | 336.3,54.36 339.85,54.36 C5.2 | 336.3,54.36 335.79,54.36 E9.10 | C1.2 367.79,54.36 361.19,54.36 E5.8 360.68,54.36 v360.68,57.4 | v336.3,57.91 336.3,54.36 | 375.41,35.05 376.94,36.58 376.94,52.32 | 308.36,53.34 309.37,53.34 309.37,54.36 C9.2 | 308.36,53.34 305.31,53.34 R3.1 304.29,53.34 303.28,52.32 299.72,52.32 299.72,52.83 R4.1 | 289.56,24.38 289.56,29.97 R19.1 | 289.56,24.38 289.56,23.37 R24.1 | 294.64,25.91 294.64,29.97 R20.1 | 294.64,25.91 294.64,24.38 | 294.64,24.38 294.64,23.37 R23.1 | 294.64,25.91 299.21,30.48 R18.1 | 294.64,24.38 289.56,24.38 | C6.2 339.85,34.04 335.79,34.04 E10.10 334.77,32 v332.74,29.97 | 308.36,53.34 308.36,36.58 309.88,35.05 C10.2 | 308.36,53.34 308.36,72.64 309.88,74.17 C8.2 | C36.2 101.09,15.75 100.08,16.76 100.08,32 101.6,33.53 C35.2 | E36.8 122.43,13.72 129.03,13.72 C33.2 | C33.2 129.54,14.73 128.02,16.26 128.02,32 129.54,33.53 C32.2 | J4.8 122.43,73.15 128.02,73.15 128.02,56.9 129.54,55.37 C31.2 | v121.92,50.29 121.92,52.32 E34.8 | C34.2 101.6,53.85 102.11,53.34 v102.11,50.29 99.57,47.75 v99.57,46.23 | v114.3,50.29 114.3,45.21 115.32,44.2 115.32,30.99 120.4,30.99 121.41,32 E35.8
  Top 0.305: J1.3 75.69,40.64 74.17,40.64 J1.5 73.15,40.64 71.63,40.64 J1.7 70.61,40.64 69.09,40.64 J1.9 68.07,40.64 66.55,40.64 J1.11 65.53,40.64 64.01,40.64 J1.13 62.99,40.64 61.47,40.64 J1.15 60.45,40.64 58.93,40.64 J1.17 57.91,40.64 56.39,40.64 J1.19 55.37,40.64 53.85,40.64 J1.21 52.83,40.64 51.31,40.64 J1.23 50.29,40.64 48.77,40.64 J1.25 47.75,40.64 46.23,40.64 J1.27 45.21,40.64 43.69,40.64 J1.29 42.67,40.64 41.15,40.64 J1.31 40.13,40.64 38.61,40.64 J1.33 37.59,40.64 36.07,40.64 J1.35 35.05,40.64 33.53,40.64 J1.37 32.51,40.64 30.99,40.64 J1.39 30.48,41.15 29.97,41.66 v29.97,54.36 | J1.1 78.23,40.64 76.71,40.64 J1.3 | R27.1 5.59,23.37 6.6,24.38 6.6,39.12 PAD8.1 6.6,42.16 5.08,43.69 5.08,75.18 9.65,79.76 9.65,80.26 C38.- | J2.16 60.96,79.25 60.96,80.77 J2.15 | J2.15 61.47,81.28 62.99,81.28 J2.13 64.01,81.28 65.53,81.28 J2.11 66.55,81.28 68.07,81.28 J2.9 69.09,81.28 70.61,81.28 J2.7 71.63,81.28 73.15,81.28 J2.5 74.17,81.28 75.69,81.28 J2.3 76.71,81.28 78.23,81.28 J2.1 | J2.39 30.99,81.28 32.51,81.28 J2.37 | J2.37 33.53,81.28 35.05,81.28 J2.35 36.07,81.28 37.59,81.28 J2.33 38.61,81.28 40.13,81.28 J2.31 41.15,81.28 42.67,81.28 J2.29 43.69,81.28 45.21,81.28 J2.27 46.23,81.28 47.75,81.28 J2.25 48.77,81.28 50.29,81.28 J2.23 51.31,81.28 52.83,81.28 J2.21 53.85,81.28 55.37,81.28 J2.19 56.39,81.28 57.91,81.28 J2.17 58.93,81.28 60.45,81.28 J2.15 | C39.- 16.26,81.79 22.35,81.79 25.91,85.34 33.02,85.34 33.02,81.79 J2.37 | v75.18,46.74 76.2,45.72 76.2,41.15 J1.3 | E18.8 254.51,34.04 255.02,34.54 255.02,51.82 254.51,52.32 E17.8
  Top 0.305: 305.82,12.7 309.37,12.7 309.37,13.72 C11.2 | 305.82,12.7 305.31,12.7 R21.1 | E14.8 282.45,32 282.96,31.5 282.96,14.22 282.45,13.72 E15.8 | J3.8 150.37,72.64 150.88,72.14 150.88,54.86 150.37,54.36 E31.8 150.37,52.32 150.37,51.31 152.4,51.31 152.91,51.82 v152.91,54.36 | v156.97,72.64 156.97,73.66 157.48,74.17 C27.2 | C29.2 157.48,33.53 156.97,33.02 156.97,28.45 157.48,27.94 157.48,21.34 155.96,19.81 155.96,16.26 157.48,14.73 C30.2 | v154.94,72.64 154.43,72.14 154.43,20.32 147.83,13.72 E33.7 | C24.2 182.37,54.36 178.31,54.36 E28.8 177.29,54.36 177.29,57.91 176.78,58.42 176.78,71.63 175.77,72.64 E27.7 | C20.2 208.79,73.15 209.3,72.64 209.3,60.96 209.8,60.45 209.8,56.9 208.28,55.37 C21.2 208.28,53.85 208.28,52.83 v207.77,52.32 207.77,49.78 206.76,48.77 206.76,36.58 208.28,35.05 C22.2 208.28,33.53 203.2,28.45 203.2,23.37 v205.74,20.83 | C16.2 233.17,74.68 226.57,74.68 E20.7 226.57,72.64 230.12,69.09 v230.12,64.01 | v238.76,57.91 238.76,59.94 E17.15 238.76,61.98 v238.76,64.01 | 260.1,13.72 261.11,13.72 C15.2 | 260.1,13.72 254.51,13.72 E19.8 | 260.1,13.72 260.1,32 261.62,33.53 C14.2 | E19.15 239.27,21.34 239.78,21.84 239.78,39.12 239.27,39.62 E18.15 | v209.3,20.32 209.8,19.81 209.8,16.26 | 209.8,16.26 208.28,14.73 C23.2 | C19.2 233.17,13.72 226.57,13.72 E23.7 225.55,11.68 225.55,10.67 212.85,10.67 212.34,11.18 212.34,13.72 209.8,16.26 | E19.1 235.71,13.72 234.19,13.72 C19.2 | 235.2,34.04 234.19,34.04 C18.2 | 235.2,34.04 235.71,34.04 E18.1 236.73,34.04 237.24,34.54 237.24,51.82 236.73,52.32 E17.1 | 235.2,34.04 235.2,16.26 233.68,14.73 C19.2 | v187.96,37.08 188.98,36.07 188.98,31.5 188.47,30.99 188.47,28.45 188.98,27.94 188.98,14.73 184.91,14.73 184.4,14.22 183.39,14.22 C26.2 182.37,14.22 175.77,7.62 175.77,7.11 v174.75,6.1
  Top 0.305: v184.91,37.08 182.88,35.05 C25.2 | v129.54,8.64 129.54,13.21 C33.2 | 305.82,12.7 305.82,28.96 304.8,29.97 R17.1
  Bottom 0.305: E3.7 385.57,11.68 384.56,10.67 382.52,10.67 381.51,11.68 E3.5 | E11.10 335.79,13.72 339.85,13.72 C7.2 340.87,14.22 341.38,14.73 348.49,14.73 349.5,13.72 349.5,10.67 359.16,10.67 360.17,11.68 E7.8 | E3.3 375.41,13.72 374.4,14.73 368.3,14.73 C3.2 | E6.8 361.19,34.04 367.79,34.04 C2.2 | E2.7 385.57,32 384.56,30.99 382.52,30.99 381.51,32 E2.5 | 384.56,55.37 385.57,54.36 E1.7 | 384.56,55.37 382.52,55.37 381.51,54.36 E1.5 | v336.3,57.91 360.17,57.91 v360.68,57.4 | E1.3 375.41,54.36 374.4,55.37 368.3,55.37 C1.2 | 384.56,55.37 384.56,62.48 373.38,73.66 361.19,73.66 E4.8 | E16.7 251.97,74.68 261.11,74.68 C12.2 262.13,75.18 262.64,75.69 274.83,75.69 275.84,74.68 275.84,71.63 280.42,71.63 281.43,72.64 E12.8 282.45,74.68 309.37,74.68 C8.2 310.39,75.18 311.4,76.2 321.56,76.2 321.56,72.14 322.07,71.63 323.6,71.63 323.6,74.68 324.61,75.69 326.14,75.69 327.15,74.68 E8.7 | 288.04,52.32 282.45,52.32 E13.8 | 288.04,52.32 289.05,53.34 R1.1 | 293.12,52.32 294.13,53.34 R2.1 | 293.12,52.32 288.04,52.32 | 293.12,52.32 298.2,52.32 299.21,53.34 R4.1 | 306.32,31.5 308.86,34.04 309.37,34.04 C10.2 309.88,35.05 313.44,35.05 313.44,32 314.96,30.48 332.23,30.48 v332.74,29.97 | 306.32,31.5 305.31,30.48 R17.1 | 306.32,31.5 301.24,31.5 300.23,30.48 R18.1 | E35.8 122.43,34.04 129.03,34.04 C32.2 | C36.2 102.11,14.73 102.11,12.19 120.4,12.19 121.41,13.21 E36.8 | E34.8 122.43,54.36 129.03,54.36 C31.2 | v121.92,50.29 v114.3,50.29 v102.11,50.29 | R27.1 5.59,23.37 9.14,26.92 11.18,26.92 12.19,25.91 R30.1 | C38.- 11.18,80.77 14.22,80.77 C39.- | v29.97,54.36 17.27,41.66 9.14,41.66 PAD8.1 | v99.57,46.23 99.06,46.74 80.26,46.74 79.76,46.23 75.69,46.23 v75.18,46.74
  Bottom 0.305: C13.2 261.11,54.36 254.51,54.36 E17.8 | E15.8 282.45,13.72 282.96,14.22 297.69,14.22 299.21,12.7 R22.1 300.23,12.7 301.24,11.68 303.28,11.68 304.29,12.7 R21.1 | 267.72,30.48 280.92,30.48 282.45,32 E14.8 | 267.72,30.48 262.13,30.48 260.6,32 254.51,32 E18.8 | v152.91,54.36 156.97,54.36 C28.2 | v156.97,72.64 v154.94,72.64 150.37,72.64 J3.8 | E32.7 147.83,34.04 156.97,34.04 C29.2 | C26.2 182.37,13.72 175.77,13.72 E30.7 174.75,13.72 173.74,14.73 157.48,14.73 C30.2 156.97,13.72 147.83,13.72 E33.7 | 186.44,35.05 186.44,31.5 185.93,30.99 179.32,30.99 178.31,32 E29.8 | 186.44,35.05 182.88,35.05 C25.2 | C22.2 207.77,34.04 201.17,34.04 E25.7 200.15,34.04 199.14,35.05 186.44,35.05 | v207.77,52.32 201.17,52.32 E24.7 | E27.7 175.77,73.15 207.77,73.15 C20.2 | E17.1 235.71,54.36 234.19,54.36 C17.2 233.17,54.36 226.57,54.36 E21.7 225.55,52.32 224.54,51.31 222.5,51.31 222.5,54.86 224.03,56.39 237.24,56.39 v238.76,57.91 | v238.76,64.01 v230.12,64.01 | 206.76,19.81 207.26,20.32 v209.3,20.32 | 206.76,19.81 205.23,18.29 197.1,18.29 196.09,19.3 E26.12 | E22.7 226.57,34.04 233.17,34.04 C18.2 233.68,35.05 238.25,39.62 E18.15 | E19.8 253.49,13.72 252.48,14.73 233.68,14.73 C19.2 | v205.74,20.83 206.76,19.81 | v184.91,37.08 v187.96,37.08 | 267.72,30.48 267.72,35.05 261.62,35.05 C14.2 | v129.54,8.64 132.08,6.1 v174.75,6.1
KEYSTB  (via drill 0.61)
  Top 0.254: v186.44,71.63 186.44,54.86 185.93,54.36 E24.1
  Bottom 0.254: v186.44,71.63 185.93,71.12 | 185.93,71.12 108.71,71.12 107.19,72.64 J4.2 | 185.93,71.12 281.94,71.12 283.46,72.64 297.69,72.64 298.7,71.63 318.52,71.63 319.53,72.64 E8.4
LDSR  (via drill 0.61)
  Top 0.254: v131.06,8.64 131.06,16.26 134.11,19.3 E33.13 | v176.78,7.11 180.34,10.67 192.02,10.67 v192.02,17.78 | v210.82,17.78 212.34,19.3 v212.34,25.91 | 359.66,39.12 360.17,39.62 E6.9 | 359.66,39.12 359.66,21.84 360.17,21.34 E7.9 | 359.66,39.12 359.66,59.44 360.17,59.94 E5.9
  Bottom 0.254: v131.06,8.64 132.59,7.11 v176.78,7.11 | v210.82,17.78 v192.02,17.78 | v212.34,25.91 212.85,26.42 355.09,26.42 360.17,21.34 E7.9
MPXA  (via drill 0.61)
  Top 0.254: 240.28,39.12 240.28,21.84 240.79,21.34 E19.14 | 240.28,39.12 240.79,39.62 E18.14 | 240.28,59.44 240.79,59.94 E17.14 | 240.28,59.44 240.28,39.12 | v111.25,85.34 111.25,83.82 109.73,82.3 J4.14 | v235.2,87.38 240.28,82.3 240.28,59.44
  Bottom 0.254: v111.25,85.34 111.76,85.85 143.76,85.85 145.8,87.88 169.16,87.88 171.7,85.34 179.83,85.34 180.85,84.33 201.68,84.33 204.72,87.38 v235.2,87.38
MPXB  (via drill 0.61)
  Top 0.254: 237.74,31.5 237.74,14.22 238.25,13.72 E19.2 | 237.74,31.5 238.25,32 E18.2 | 237.74,51.82 238.25,52.32 E17.2 | 237.74,51.82 237.74,31.5 | v112.27,86.87 112.27,82.3 J4.13 | v171.2,87.38 176.78,87.38 v176.78,77.72 | v237.74,77.72 237.74,51.82
  Bottom 0.254: v112.27,86.87 113.79,88.39 170.18,88.39 v171.2,87.38 | v176.78,77.72 177.29,77.22 218.95,77.22 219.46,77.72 v237.74,77.72
N$1  (via drill 0.61)
  Top 0.254: v331.72,36.58 331.72,35.05 330.71,34.04 E10.8
  Bottom 0.254: v331.72,36.58 346.96,36.58 348.49,38.1 | 348.49,38.1 350.01,39.62 E6.13 | 348.49,38.1 373.89,38.1 375.41,39.62 E2.12
N$2
  Top 0.254: E9.8 330.71,52.32 331.72,51.31 341.88,51.31 341.88,57.4 343.41,58.93 350.01,58.93 350.01,59.94 E5.13
  Bottom 0.254: E1.12 375.41,59.94 373.89,58.42 352.55,58.42 351.03,59.94 E5.13
N$3
  Bottom 0.254: E9.2 315.47,54.36 316.99,55.88 348.49,55.88 350.01,54.36 E5.4 351.03,54.36 353.06,56.39 374.4,56.39 377.95,59.94 E1.11
N$4
  Bottom 0.254: E9.4 320.55,52.32 321.56,51.31 351.54,51.31 352.55,52.32 E5.5 353.57,54.36 355.09,55.88 376.43,55.88 380.49,59.94 E1.10
N$5
  Bottom 0.254: 349,30.99 316.48,30.99 315.47,32 E10.2 | 349,30.99 350.01,32 E6.4 | 349,30.99 369.82,30.99 369.82,34.54 370.33,35.05 382.02,35.05 382.02,42.16 381.51,42.67 379.98,42.67 378.97,41.66 E2.11
N$6
  Bottom 0.254: 351.03,35.56 322.07,35.56 320.55,34.04 E10.4 | 351.03,35.56 352.55,34.04 E6.5 | 351.03,35.56 376.43,35.56 380.49,39.62 E2.10
N$7  (via drill 0.61)
  Top 0.254: v331.72,16.26 331.72,14.73 330.71,13.72 E11.8
  Bottom 0.254: v331.72,16.26 346.96,16.26 348.49,17.78 | 348.49,17.78 350.01,19.3 E7.13 | 348.49,17.78 373.89,17.78 375.41,19.3 E3.12
N$8  (via drill 0.61)
  Top 0.254: E11.2 315.47,13.72 316.48,14.73 316.48,21.84 316.99,22.35 334.26,22.35 334.26,17.78 341.88,10.16 350.01,10.16 350.01,11.68 E7.4 351.03,13.72 v351.03,16.26
  Bottom 0.254: v351.03,16.26 374.9,16.26 377.95,19.3 E3.11
N$9
  Bottom 0.254: 351.03,15.24 322.07,15.24 320.55,13.72 E11.4 | 351.03,15.24 352.55,13.72 E7.5 | 351.03,15.24 376.43,15.24 380.49,19.3 E3.10
N$10
  Bottom 0.254: E19.3 241.81,11.68 242.82,10.67 265.18,10.67 266.19,11.68 E15.2
N$11
  Top 0.254: E19.5 246.89,11.68 247.4,11.18 247.4,10.67 247.9,10.16 273.81,10.16 273.81,11.68 E15.5
N$12  (via drill 0.61)
  Top 0.254: v254.51,25.4 254.51,26.42 249.94,26.42 245.36,21.84 245.36,14.73 244.35,13.72 E19.4 | v278.38,25.4 278.38,14.22 278.89,13.72 E15.7
  Bottom 0.254: v254.51,25.4 v278.38,25.4
N$13  (via drill 0.61)
  Top 0.254: v249.94,23.37 249.94,14.22 249.43,13.72 E19.6
  Bottom 0.254: v249.94,23.37 250.44,22.86 277.88,22.86 279.4,21.34 E15.10
N$14
  Bottom 0.254: E19.13 244.35,19.3 246.38,17.27 271.78,17.27 273.81,19.3 E15.12
N$15
  Bottom 0.254: E19.11 249.43,21.34 250.44,22.35 265.18,22.35 266.19,21.34 E15.15
N$16
  Top 0.254: E19.12 246.89,19.3 247.9,18.29 247.9,11.18 248.41,10.67 265.68,10.67 265.68,51.82 266.19,52.32 E13.2
N$17  (via drill 0.61)
  Top 0.254: v256.54,51.82 256.54,18.29 252.98,18.29 251.97,19.3 E19.10
  Bottom 0.254: v256.54,51.82 257.05,51.31 267.21,51.31 268.22,52.32 268.22,55.37 272.8,55.37 273.81,54.36 E13.5
N$18  (via drill 0.61)
  Top 0.254: v244.35,46.23 242.82,44.7 242.82,35.05 241.81,34.04 E18.3 | v275.34,48.77 278.89,52.32 E13.7
  Bottom 0.254: v244.35,46.23 245.36,47.24 273.81,47.24 v275.34,48.77
N$19  (via drill 0.61)
  Top 0.254: v247.4,56.9 247.4,34.54 246.89,34.04 E18.5 | v278.89,57.4 278.89,59.94 E13.10
  Bottom 0.254: v247.4,56.9 247.9,57.4 v278.89,57.4
N$20  (via drill 0.61)
  Top 0.254: v245.36,57.91 245.36,35.05 244.35,34.04 E18.4
  Bottom 0.254: v245.36,57.91 246.38,58.93 258.57,58.93 262.64,62.99 272.8,62.99 273.81,61.98 E13.12
N$21  (via drill 0.61)
  Top 0.254: v257.56,30.99 260.1,33.53 260.1,75.69 263.65,79.25 265.68,79.25 265.68,62.48 266.19,61.98 E13.15
  Bottom 0.254: v257.56,30.99 250.44,30.99 249.43,32 E18.6
N$22
  Bottom 0.254: E18.13 244.35,39.62 244.35,35.05 258.57,35.05 262.64,30.99 265.18,30.99 266.19,32 E14.2
N$23
  Bottom 0.254: E18.11 249.43,39.62 251.46,37.59 277.37,37.59 280.42,34.54 280.42,30.99 275.84,30.99 274.83,32 E14.5
N$24
  Bottom 0.254: E18.12 246.89,39.62 246.89,35.56 269.75,35.56 270.26,35.05 277.88,35.05 278.89,34.04 E14.7
N$25
  Bottom 0.254: E18.10 251.97,41.66 253.49,43.18 270.76,43.18 271.27,42.67 277.88,42.67 278.89,41.66 E14.10
N$26  (via drill 0.61)
  Top 0.254: v252.48,77.22 252.48,62.48 251.97,61.98 E17.10
  Bottom 0.254: v252.48,77.22 264.67,77.22 266.19,78.74 266.19,80.26 E12.15
N$27  (via drill 0.61)
  Top 0.254: v275.34,64.01 275.34,79.76 274.83,80.26 E12.12
  Bottom 0.254: v275.34,64.01 248.92,64.01 246.89,61.98 E17.12
N$28  (via drill 0.61)
  Top 0.254: v278.89,62.99 278.38,63.5 278.38,79.76 278.89,80.26 E12.10
  Bottom 0.254: v278.89,62.99 274.83,62.99 274.32,63.5 250.95,63.5 249.43,61.98 E17.11
N$29  (via drill 0.61)
  Top 0.254: v245.36,75.69 245.36,62.99 244.35,61.98 E17.13
  Bottom 0.254: v245.36,75.69 245.87,76.2 277.37,76.2 278.89,74.68 E12.7
N$30  (via drill 0.61)
  Top 0.254: v268.22,50.8 267.21,49.78 267.21,41.66 E14.15
  Bottom 0.254: v268.22,50.8 248.41,50.8 246.89,52.32 E17.5
N$31  (via drill 0.61)
  Top 0.254: v242.32,46.23 242.32,51.82 241.81,52.32 E17.3 | v274.32,45.72 274.32,41.66 E14.12
  Bottom 0.254: v242.32,46.23 243.33,45.21 269.75,45.21 270.26,45.72 v274.32,45.72
N$32  (via drill 0.61)
  Top 0.254: v264.16,55.37 267.72,58.93 267.72,72.14 267.21,72.64 E12.2
  Bottom 0.254: v264.16,55.37 263.65,55.88 260.6,55.88 260.1,55.37 245.36,55.37 244.35,54.36 E17.4
N$33  (via drill 0.61)
  Top 0.254: v253.49,72.14 252.98,71.63 252.98,57.91 249.43,54.36 E17.6